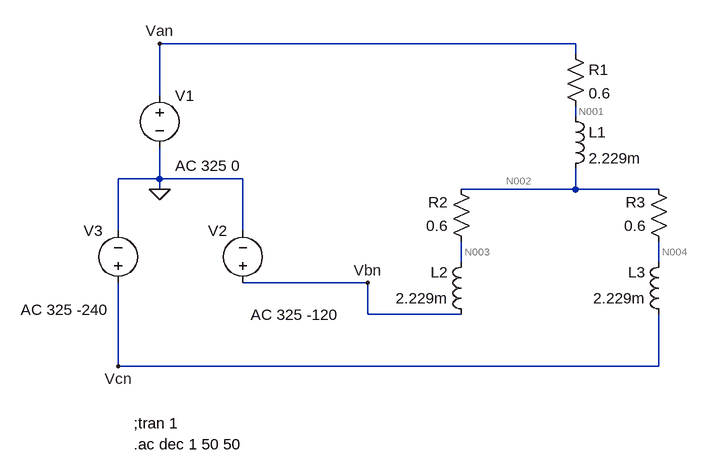
[diagram p0: schematic Draft1.asc]
Draft1.asc, the LTspice schematic file:
Version 4
SHEET 1 880 680
WIRE 592 -16 -48 -16
WIRE 592 0 592 -16
WIRE -48 64 -48 -16
WIRE 592 96 592 80
WIRE -48 192 -48 144
WIRE -48 192 -112 192
WIRE 80 192 -48 192
WIRE -48 208 -48 192
WIRE 592 208 592 176
WIRE 592 208 416 208
WIRE 720 208 592 208
WIRE -112 272 -112 192
WIRE 80 272 80 192
WIRE 416 320 416 288
WIRE 720 320 720 288
WIRE 272 352 80 352
WIRE 272 400 272 352
WIRE 416 400 272 400
WIRE -112 480 -112 352
WIRE 720 480 720 400
WIRE 720 480 -112 480
FLAG -48 208 0
FLAG 272 352 Vbn
FLAG -112 480 Vcn
FLAG -48 -16 Van
SYMBOL voltage -48 48 R0
WINDOW 123 24 124 Left 2
WINDOW 39 0 0 Left 0
SYMATTR InstName V1
SYMATTR Value ""
SYMATTR Value2 AC 325 0
SYMBOL voltage 80 368 R180
WINDOW 0 24 96 Left 2
WINDOW 3 -148 -5 Left 2
WINDOW 123 -148 -33 Left 2
WINDOW 39 0 0 Left 0
SYMATTR InstName V2
SYMATTR Value ""
SYMATTR Value2 AC 325 -120
SYMBOL voltage -112 368 R180
WINDOW 0 24 96 Left 2
WINDOW 3 14 3 Left 2
WINDOW 123 14 -25 Left 2
WINDOW 39 0 0 Left 0
SYMATTR InstName V3
SYMATTR Value ""
SYMATTR Value2 AC 325 -240
SYMBOL res 576 -16 R0
SYMATTR InstName R1
SYMATTR Value 0.6
SYMBOL res 432 304 R180
WINDOW 0 36 76 Left 2
WINDOW 3 36 40 Left 2
SYMATTR InstName R2
SYMATTR Value 0.6
SYMBOL res 736 304 R180
WINDOW 0 36 76 Left 2
WINDOW 3 36 40 Left 2
SYMATTR InstName R3
SYMATTR Value 0.6
SYMBOL ind 576 80 R0
SYMATTR InstName L1
SYMATTR Value 2.229m
SYMBOL ind 432 416 R180
WINDOW 0 36 80 Left 2
WINDOW 3 36 40 Left 2
SYMATTR InstName L2
SYMATTR Value 2.229m
SYMBOL ind 736 416 R180
WINDOW 0 36 80 Left 2
WINDOW 3 36 40 Left 2
SYMATTR InstName L3
SYMATTR Value 2.229m
TEXT -88 568 Left 2 !;tran 1
TEXT -88 600 Left 2 !.ac dec 1 50 50

The netlist it stands for:
* Draft1.asc
V1 Van 0 AC 325 0
V2 Vbn 0 AC 325 -120
V3 Vcn 0 AC 325 -240
R1 Van N001 0.6
R2 N003 N002 0.6
R3 N004 N002 0.6
L1 N001 N002 2.229m
L2 Vbn N003 2.229m
L3 Vcn N004 2.229m
;tran 1
.ac dec 1 50 50
.backanno
.end

* Results of the author's LTspice run, read from the files saved beside the schematic
* AC Analysis:
*   frequency = 50 
*   V(van) = 325 V
*   V(vbn) = -162.5 V
*   V(vcn) = -162.5 V
*   V(n001) = 187.4 V
*   V(n003) = -207.7 V
*   V(n002) = -28.42 fV
*   V(n004) = 70.06 V
*   I(L3) = 116.8 A
*   I(L2) = -346.1 A
*   I(L1) = 229.4 A
*   I(R3) = 116.8 A
*   I(R2) = -346.1 A
*   I(R1) = 229.4 A
*   I(V3) = -116.8 A
*   I(V2) = 346.1 A
*   I(V1) = -229.4 A